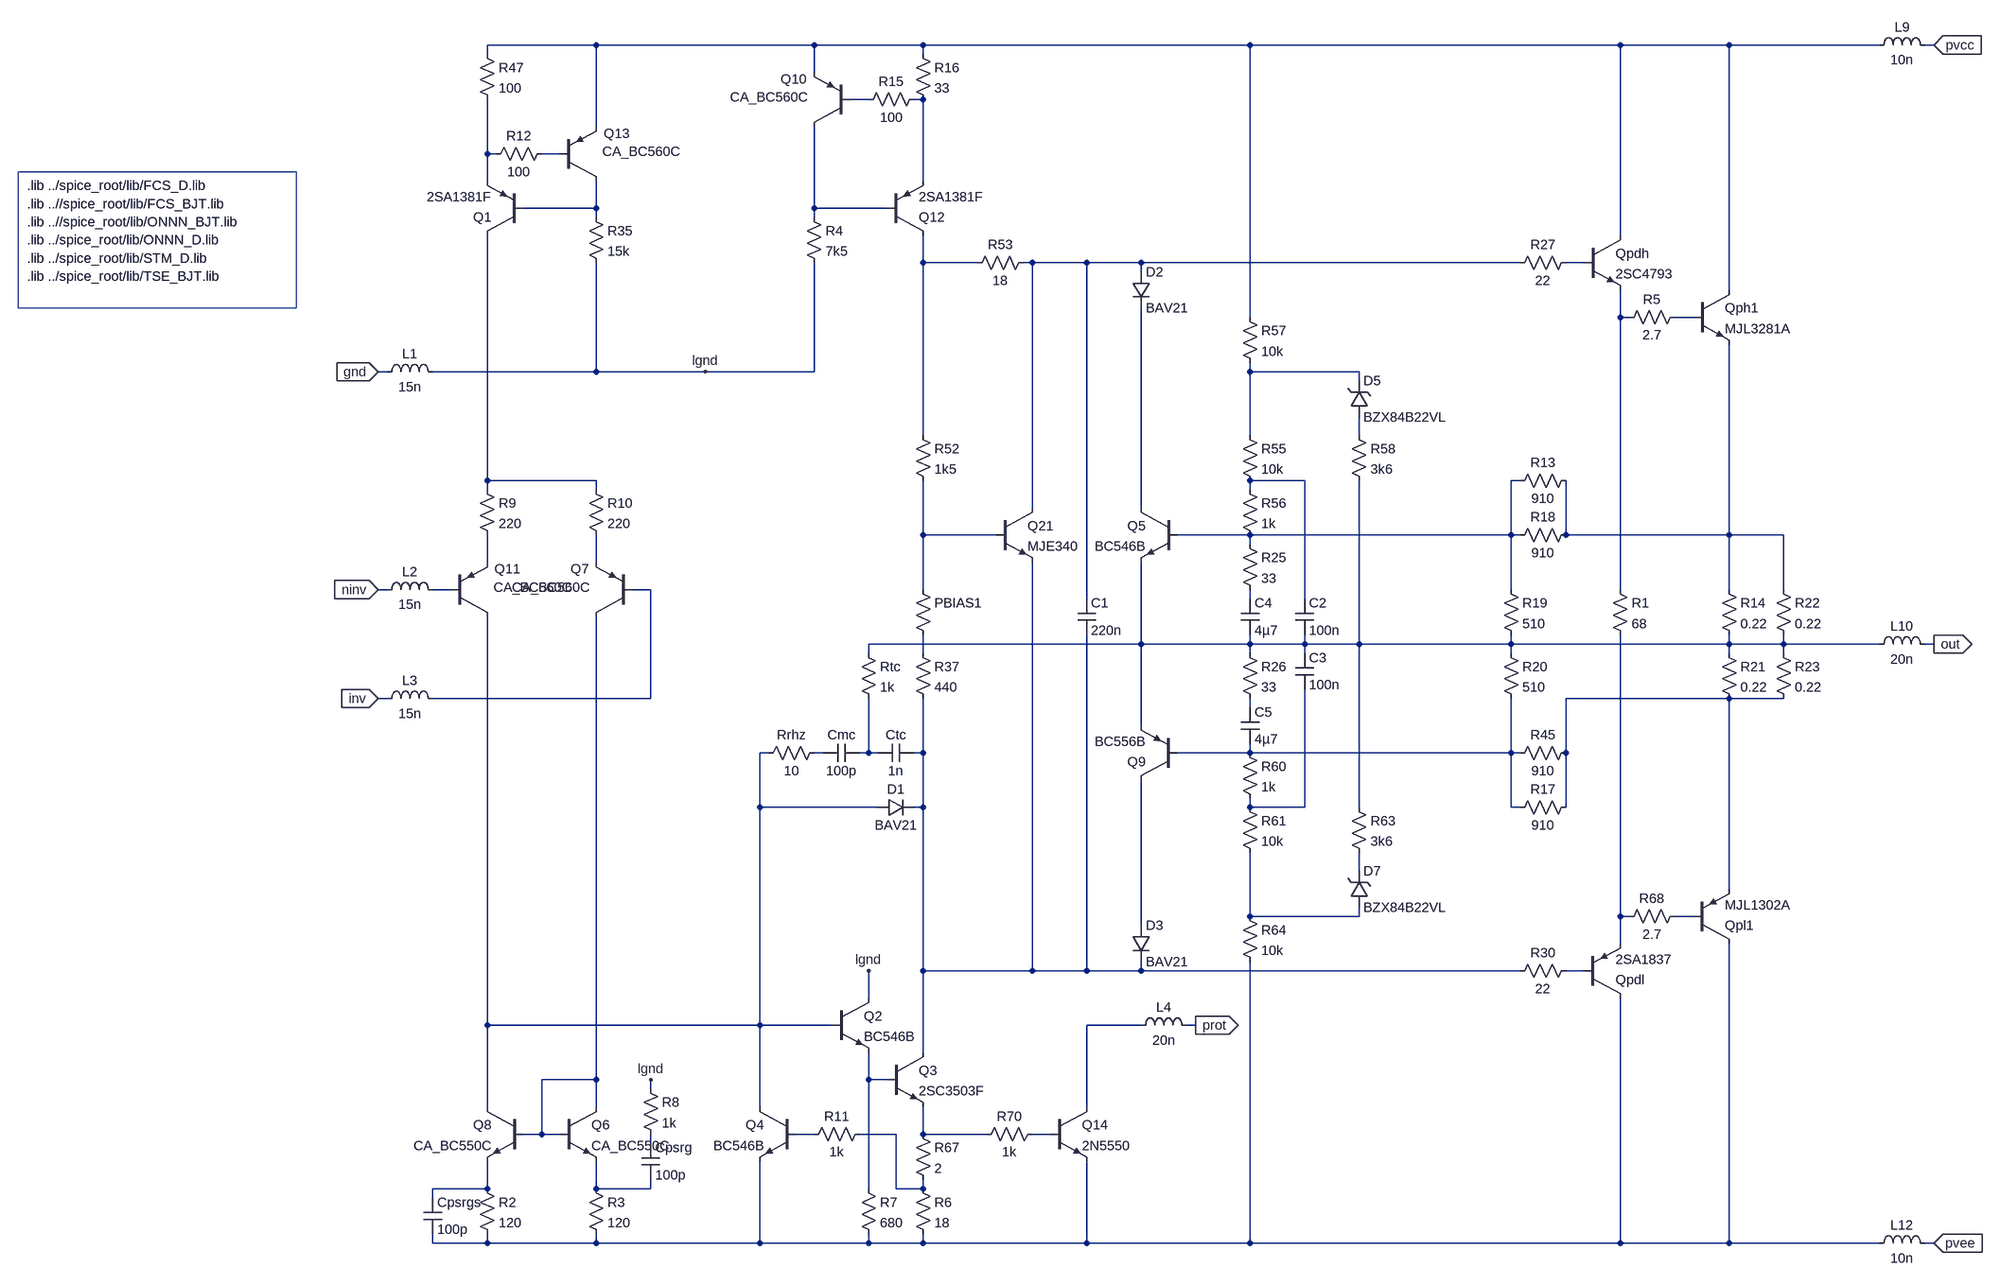
[diagram p0: schematic pab3bbb-compact-module-v2.asc]
pab3bbb-compact-module-v2.asc, the LTspice schematic file:
Version 4
SHEET 1 6124 2336
WIRE -192 -1280 -384 -1280
WIRE 192 -1280 -192 -1280
WIRE 384 -1280 192 -1280
WIRE 960 -1280 384 -1280
WIRE 1632 -1280 960 -1280
WIRE 1824 -1280 1632 -1280
WIRE 2592 -1280 1824 -1280
WIRE 2688 -1280 2672 -1280
WIRE -384 -1264 -384 -1280
WIRE 384 -1264 384 -1280
WIRE 192 -1232 192 -1280
WIRE 288 -1184 256 -1184
WIRE 384 -1184 368 -1184
WIRE -192 -1136 -192 -1280
WIRE -384 -1088 -384 -1184
WIRE -368 -1088 -384 -1088
WIRE -256 -1088 -288 -1088
WIRE -384 -1040 -384 -1088
WIRE 384 -1040 384 -1184
WIRE -192 -992 -192 -1040
WIRE -192 -992 -320 -992
WIRE 192 -992 192 -1136
WIRE 320 -992 192 -992
WIRE -192 -976 -192 -992
WIRE 192 -976 192 -992
WIRE 1632 -944 1632 -1280
WIRE 384 -896 384 -944
WIRE 480 -896 384 -896
WIRE 576 -896 560 -896
WIRE 672 -896 576 -896
WIRE 768 -896 672 -896
WIRE 1456 -896 768 -896
WIRE 1568 -896 1536 -896
WIRE 768 -880 768 -896
WIRE 1824 -848 1824 -1280
WIRE 960 -800 960 -1280
WIRE 1632 -800 1632 -848
WIRE 1648 -800 1632 -800
WIRE 1760 -800 1728 -800
WIRE -560 -704 -576 -704
WIRE -192 -704 -192 -896
WIRE -192 -704 -480 -704
WIRE 0 -704 -192 -704
WIRE 192 -704 192 -896
WIRE 192 -704 0 -704
WIRE 960 -704 960 -720
WIRE 1152 -704 960 -704
WIRE 1152 -688 1152 -704
WIRE 384 -592 384 -896
WIRE 960 -592 960 -704
WIRE 1152 -592 1152 -624
WIRE -384 -512 -384 -944
WIRE -192 -512 -384 -512
WIRE 1056 -512 960 -512
WIRE 1456 -512 1440 -512
WIRE -384 -496 -384 -512
WIRE -192 -496 -192 -512
WIRE 960 -496 960 -512
WIRE 576 -464 576 -896
WIRE 768 -464 768 -816
WIRE 384 -416 384 -512
WIRE 512 -416 384 -416
WIRE 960 -416 832 -416
WIRE 1440 -416 1440 -512
WIRE 1440 -416 960 -416
WIRE 1456 -416 1440 -416
WIRE 1536 -416 1536 -512
WIRE 1824 -416 1824 -752
WIRE 1824 -416 1536 -416
WIRE 1920 -416 1824 -416
WIRE 960 -400 960 -416
WIRE -384 -368 -384 -416
WIRE -192 -368 -192 -416
WIRE -560 -320 -576 -320
WIRE -448 -320 -480 -320
WIRE -96 -320 -128 -320
WIRE 384 -320 384 -416
WIRE 1440 -320 1440 -416
WIRE 1632 -320 1632 -800
WIRE 1824 -320 1824 -416
WIRE 1920 -320 1920 -416
WIRE 672 -304 672 -896
WIRE 960 -304 960 -320
WIRE 1056 -304 1056 -512
WIRE 768 -224 768 -368
WIRE 768 -224 288 -224
WIRE 960 -224 960 -240
WIRE 960 -224 768 -224
WIRE 1056 -224 1056 -240
WIRE 1056 -224 960 -224
WIRE 1152 -224 1152 -512
WIRE 1152 -224 1056 -224
WIRE 1440 -224 1440 -240
WIRE 1440 -224 1152 -224
WIRE 1824 -224 1824 -240
WIRE 1824 -224 1440 -224
WIRE 1920 -224 1920 -240
WIRE 1920 -224 1824 -224
WIRE 2592 -224 1920 -224
WIRE 2688 -224 2672 -224
WIRE 288 -208 288 -224
WIRE 384 -208 384 -240
WIRE 960 -208 960 -224
WIRE 1056 -208 1056 -224
WIRE 1440 -208 1440 -224
WIRE 1824 -208 1824 -224
WIRE 1920 -208 1920 -224
WIRE -560 -128 -576 -128
WIRE -96 -128 -96 -320
WIRE -96 -128 -480 -128
WIRE 1824 -128 1536 -128
WIRE 1920 -128 1824 -128
WIRE 960 -112 960 -128
WIRE 768 -80 768 -224
WIRE 112 -32 96 -32
WIRE 208 -32 192 -32
WIRE 288 -32 288 -128
WIRE 288 -32 272 -32
WIRE 304 -32 288 -32
WIRE 384 -32 384 -128
WIRE 384 -32 368 -32
WIRE 960 -32 960 -48
WIRE 960 -32 832 -32
WIRE 1440 -32 1440 -128
WIRE 1440 -32 960 -32
WIRE 1456 -32 1440 -32
WIRE 1536 -32 1536 -128
WIRE 96 64 96 -32
WIRE 304 64 96 64
WIRE 384 64 384 -32
WIRE 384 64 368 64
WIRE 960 64 960 48
WIRE 1056 64 1056 -144
WIRE 1056 64 960 64
WIRE 1152 64 1152 -224
WIRE 1440 64 1440 -32
WIRE 1456 64 1440 64
WIRE 1536 64 1536 -32
WIRE 1152 176 1152 144
WIRE 1824 208 1824 -128
WIRE 960 256 960 144
WIRE 1152 256 1152 240
WIRE 1152 256 960 256
WIRE 1632 256 1632 -240
WIRE 1648 256 1632 256
WIRE 1760 256 1728 256
WIRE 768 272 768 16
WIRE 1632 304 1632 256
WIRE 384 352 384 64
WIRE 576 352 576 -368
WIRE 576 352 384 352
WIRE 672 352 672 -240
WIRE 672 352 576 352
WIRE 768 352 768 336
WIRE 768 352 672 352
WIRE 1456 352 768 352
WIRE 1568 352 1536 352
WIRE 288 400 288 352
WIRE -384 448 -384 -272
WIRE 96 448 96 64
WIRE 96 448 -384 448
WIRE 224 448 96 448
WIRE 768 448 672 448
WIRE 864 448 848 448
WIRE 384 496 384 352
WIRE -192 544 -192 -272
WIRE -192 544 -288 544
WIRE 288 544 288 496
WIRE 320 544 288 544
WIRE -96 560 -96 544
WIRE -384 592 -384 448
WIRE -192 592 -192 544
WIRE 96 592 96 448
WIRE 672 592 672 448
WIRE -288 640 -288 544
WIRE -288 640 -320 640
WIRE -256 640 -288 640
WIRE 192 640 160 640
WIRE 336 640 272 640
WIRE 384 640 384 592
WIRE 496 640 384 640
WIRE 608 640 576 640
WIRE -96 656 -96 640
WIRE -384 736 -384 688
WIRE -384 736 -480 736
WIRE -192 736 -192 688
WIRE -96 736 -96 720
WIRE -96 736 -192 736
WIRE 288 736 288 544
WIRE 336 736 336 640
WIRE 384 736 384 720
WIRE 384 736 336 736
WIRE -480 752 -480 736
WIRE -480 832 -480 816
WIRE -384 832 -384 816
WIRE -384 832 -480 832
WIRE -192 832 -192 816
WIRE -192 832 -384 832
WIRE 96 832 96 688
WIRE 96 832 -192 832
WIRE 288 832 288 816
WIRE 288 832 96 832
WIRE 384 832 384 816
WIRE 384 832 288 832
WIRE 672 832 672 688
WIRE 672 832 384 832
WIRE 960 832 960 336
WIRE 960 832 672 832
WIRE 1632 832 1632 400
WIRE 1632 832 960 832
WIRE 1824 832 1824 304
WIRE 1824 832 1632 832
WIRE 2592 832 1824 832
WIRE 2688 832 2672 832
FLAG 2688 -1280 pvcc
IOPIN 2688 -1280 In
FLAG 2688 832 pvee
IOPIN 2688 832 In
FLAG 2688 -224 out
IOPIN 2688 -224 Out
FLAG -576 -320 ninv
IOPIN -576 -320 In
FLAG -576 -128 inv
IOPIN -576 -128 In
FLAG -576 -704 gnd
IOPIN -576 -704 In
FLAG 0 -704 lgnd
FLAG 288 352 lgnd
FLAG -96 544 lgnd
FLAG 864 448 prot
IOPIN 864 448 Out
SYMBOL pnp -448 -272 M180
WINDOW 0 77 84 Left 2
WINDOW 3 75 52 Left 2
SYMATTR InstName Q11
SYMATTR Value CA_BC560C
SYMBOL res -400 720 R0
SYMATTR InstName R2
SYMATTR Value 120
SYMBOL res -208 720 R0
SYMATTR InstName R3
SYMATTR Value 120
SYMBOL res -400 -512 R0
SYMATTR InstName R9
SYMATTR Value 220
SYMBOL res -208 -512 R0
SYMATTR InstName R10
SYMATTR Value 220
SYMBOL res 368 -1280 R0
SYMATTR InstName R16
SYMATTR Value 33
SYMBOL pnp 320 -944 M180
SYMATTR InstName Q12
SYMATTR Value 2SA1381F
SYMBOL res 1552 -912 R90
WINDOW 0 0 56 VBottom 2
WINDOW 3 32 56 VTop 2
SYMATTR InstName R27
SYMATTR Value 22
SYMBOL res 1552 336 R90
WINDOW 0 0 56 VBottom 2
WINDOW 3 32 56 VTop 2
SYMATTR InstName R30
SYMATTR Value 22
SYMBOL res -400 -1280 R0
SYMATTR InstName R47
SYMATTR Value 100
SYMBOL res 368 -336 R0
WINDOW 3 36 76 Invisible 2
SYMATTR Value {1+(500*BIAS)}
SYMATTR InstName PBIAS1
SYMBOL res 368 -608 R0
SYMATTR InstName R52
SYMATTR Value 1k5
SYMBOL res 576 -912 R90
WINDOW 0 0 56 VBottom 2
WINDOW 3 32 56 VTop 2
SYMATTR InstName R53
SYMATTR Value 18
SYMBOL npn 320 496 R0
SYMATTR InstName Q3
SYMATTR Value 2SC3503F
SYMBOL res 368 720 R0
SYMATTR InstName R6
SYMATTR Value 18
SYMBOL res 176 -992 R0
SYMATTR InstName R4
SYMATTR Value 7k5
SYMBOL pnp -320 -944 R180
SYMATTR InstName Q1
SYMATTR Value 2SA1381F
SYMBOL pnp -128 -272 R180
WINDOW 0 77 84 Left 2
WINDOW 3 75 52 Left 2
SYMATTR InstName Q7
SYMATTR Value CA_BC560C
SYMBOL npn 512 -464 R0
SYMATTR InstName Q21
SYMATTR Value MJE340
SYMBOL res 368 -224 R0
SYMATTR InstName R37
SYMATTR Value 440
SYMBOL npn 1760 -848 R0
SYMATTR InstName Qph1
SYMATTR Value MJL3281A
SYMBOL pnp 1760 304 M180
SYMATTR InstName Qpl1
SYMATTR Value MJL1302A
SYMBOL res 1744 -816 R90
WINDOW 0 0 56 VBottom 2
WINDOW 3 32 56 VTop 2
SYMATTR InstName R5
SYMATTR Value 2.7
SYMBOL res 1744 240 R90
WINDOW 0 0 56 VBottom 2
WINDOW 3 32 56 VTop 2
SYMATTR InstName R68
SYMATTR Value 2.7
SYMBOL cap 272 -48 R90
WINDOW 0 0 32 VBottom 2
WINDOW 3 32 32 VTop 2
SYMATTR InstName Cmc
SYMATTR Value 100p
SYMATTR SpiceLine V=100 Irms=20.8m Rser=5.448 Lser=3n Rpar=6.4meg Cpar=1p
SYMBOL npn -256 592 R0
SYMATTR InstName Q6
SYMATTR Value CA_BC550C
SYMBOL npn -320 592 M0
SYMATTR InstName Q8
SYMATTR Value CA_BC550C
SYMBOL res 384 -1200 R90
WINDOW 0 0 56 VBottom 2
WINDOW 3 32 56 VTop 2
SYMATTR InstName R15
SYMATTR Value 100
SYMBOL npn 224 400 R0
SYMATTR InstName Q2
SYMATTR Value BC546B
SYMBOL res 272 720 R0
SYMATTR InstName R7
SYMATTR Value 680
SYMBOL cap 368 -48 R90
WINDOW 0 0 32 VBottom 2
WINDOW 3 32 32 VTop 2
SYMATTR InstName Ctc
SYMATTR Value 1n
SYMATTR SpiceLine V=100 Irms=75.3m Rser=2.89088 Lser=3n Rpar=4.4meg Cpar=1p
SYMBOL res 272 -224 R0
SYMATTR InstName Rtc
SYMATTR Value 1k
SYMBOL diode 304 80 R270
WINDOW 0 32 32 VTop 2
WINDOW 3 0 32 VBottom 2
SYMATTR InstName D1
SYMATTR Value BAV21
SYMBOL pnp 256 -1136 R180
WINDOW 0 77 84 Left 2
WINDOW 3 75 52 Left 2
SYMATTR InstName Q10
SYMATTR Value CA_BC560C
SYMBOL res 1808 -336 R0
SYMATTR InstName R14
SYMATTR Value 0.22
SYMBOL res 1808 -224 R0
SYMATTR InstName R21
SYMATTR Value 0.22
SYMBOL res -208 -992 R0
SYMATTR InstName R35
SYMATTR Value 15k
SYMBOL cap 656 -240 M180
WINDOW 0 24 56 Left 2
WINDOW 3 24 8 Left 2
SYMATTR InstName C1
SYMATTR Value 220n
SYMATTR SpiceLine V=25 Irms=1.76 Rser=0.057522 Lser=3n Rpar=4.4meg Cpar=1p
SYMBOL ind -576 -688 R270
WINDOW 0 32 56 VTop 2
WINDOW 3 5 56 VBottom 2
SYMATTR InstName L1
SYMATTR Value 15n
SYMATTR SpiceLine Rser=20m
SYMBOL ind -576 -304 R270
WINDOW 0 32 56 VTop 2
WINDOW 3 5 56 VBottom 2
SYMATTR InstName L2
SYMATTR Value 15n
SYMATTR SpiceLine Rser=20m
SYMBOL ind -576 -112 R270
WINDOW 0 32 56 VTop 2
WINDOW 3 5 56 VBottom 2
SYMATTR InstName L3
SYMATTR Value 15n
SYMATTR SpiceLine Rser=20m
SYMBOL ind 2576 -208 R270
WINDOW 0 32 56 VTop 2
WINDOW 3 5 56 VBottom 2
SYMATTR InstName L10
SYMATTR Value 20n
SYMATTR SpiceLine Rser=10m
SYMBOL ind 2576 -1264 R270
WINDOW 0 32 56 VTop 2
WINDOW 3 5 56 VBottom 2
SYMATTR InstName L9
SYMATTR Value 10n
SYMATTR SpiceLine Rser=10m
SYMBOL ind 2576 848 R270
WINDOW 0 32 56 VTop 2
WINDOW 3 5 56 VBottom 2
SYMATTR InstName L12
SYMATTR Value 10n
SYMATTR SpiceLine Rser=10m
SYMBOL pnp -256 -1040 M180
WINDOW 0 77 84 Left 2
WINDOW 3 75 52 Left 2
SYMATTR InstName Q13
SYMATTR Value CA_BC560C
SYMBOL res -272 -1104 R90
WINDOW 0 0 56 VBottom 2
WINDOW 3 32 56 VTop 2
SYMATTR InstName R12
SYMATTR Value 100
SYMBOL npn 1568 -944 R0
SYMATTR InstName Qpdh
SYMATTR Value 2SC4793
SYMBOL pnp 1568 400 M180
SYMATTR InstName Qpdl
SYMATTR Value 2SA1837
SYMBOL res 1616 -336 R0
SYMATTR InstName R1
SYMATTR Value 68
SYMBOL cap -496 752 R0
SYMATTR InstName Cpsrgs
SYMATTR Value 100p
SYMATTR SpiceLine V=100 Irms=20.8m Rser=5.448 Lser=3n Rpar=6.4meg Cpar=1p
SYMBOL cap -112 656 R0
SYMATTR InstName Cpsrg
SYMATTR Value 100p
SYMATTR SpiceLine V=100 Irms=20.8m Rser=5.448 Lser=3n Rpar=6.4meg Cpar=1p
SYMBOL res 1904 -336 R0
SYMATTR InstName R22
SYMATTR Value 0.22
SYMBOL res 1904 -224 R0
SYMATTR InstName R23
SYMATTR Value 0.22
SYMBOL res 208 -48 R90
WINDOW 0 0 56 VBottom 2
WINDOW 3 32 56 VTop 2
SYMATTR InstName Rrhz
SYMATTR Value 10
SYMBOL ind 752 464 R270
WINDOW 0 32 56 VTop 2
WINDOW 3 5 56 VBottom 2
SYMATTR InstName L4
SYMATTR Value 20n
SYMATTR SpiceLine Rser=10m
SYMBOL npn 160 592 M0
SYMATTR InstName Q4
SYMATTR Value BC546B
SYMBOL res 288 624 R90
WINDOW 0 0 56 VBottom 2
WINDOW 3 32 56 VTop 2
SYMATTR InstName R11
SYMATTR Value 1k
SYMBOL npn 832 -464 M0
SYMATTR InstName Q5
SYMATTR Value BC546B
SYMBOL res 1552 -432 R90
WINDOW 0 0 56 VBottom 2
WINDOW 3 32 56 VTop 2
SYMATTR InstName R18
SYMATTR Value 910
SYMBOL res 1424 -336 R0
SYMATTR InstName R19
SYMATTR Value 510
SYMBOL diode 752 -880 R0
SYMATTR InstName D2
SYMATTR Value BAV21
SYMBOL pnp 832 16 R180
SYMATTR InstName Q9
SYMATTR Value BC556B
SYMBOL res 1424 -224 R0
SYMATTR InstName R20
SYMATTR Value 510
SYMBOL res 1552 -48 R90
WINDOW 0 0 56 VBottom 2
WINDOW 3 32 56 VTop 2
SYMATTR InstName R45
SYMATTR Value 910
SYMBOL diode 752 272 R0
SYMATTR InstName D3
SYMATTR Value BAV21
SYMBOL res 944 -608 R0
SYMATTR InstName R55
SYMATTR Value 10k
SYMBOL res 944 -512 R0
SYMATTR InstName R56
SYMATTR Value 1k
SYMBOL res 944 -816 R0
SYMATTR InstName R57
SYMATTR Value 10k
SYMBOL zener 1136 -624 M180
WINDOW 0 24 64 Left 2
WINDOW 3 24 0 Left 2
SYMATTR InstName D5
SYMATTR Value BZX84B22VL
SYMATTR Description Diode
SYMATTR Type diode
SYMBOL res 1136 -608 R0
SYMATTR InstName R58
SYMATTR Value 3k6
SYMBOL res 944 -48 R0
SYMATTR InstName R60
SYMATTR Value 1k
SYMBOL res 944 48 R0
SYMATTR InstName R61
SYMATTR Value 10k
SYMBOL res 1136 48 R0
SYMATTR InstName R63
SYMATTR Value 3k6
SYMBOL zener 1136 240 M180
WINDOW 0 24 64 Left 2
WINDOW 3 24 0 Left 2
SYMATTR InstName D7
SYMATTR Value BZX84B22VL
SYMATTR Description Diode
SYMATTR Type diode
SYMBOL res 944 240 R0
SYMATTR InstName R64
SYMATTR Value 10k
SYMBOL res 368 624 R0
SYMATTR InstName R67
SYMATTR Value 2
SYMBOL npn 608 592 R0
SYMATTR InstName Q14
SYMATTR Value 2N5550
SYMBOL res 592 624 R90
WINDOW 0 0 56 VBottom 2
WINDOW 3 32 56 VTop 2
SYMATTR InstName R70
SYMATTR Value 1k
SYMBOL res 1552 -528 R90
WINDOW 0 0 56 VBottom 2
WINDOW 3 32 56 VTop 2
SYMATTR InstName R13
SYMATTR Value 910
SYMBOL res 1552 48 R90
WINDOW 0 0 56 VBottom 2
WINDOW 3 32 56 VTop 2
SYMATTR InstName R17
SYMATTR Value 910
SYMBOL res 944 -416 R0
SYMATTR InstName R25
SYMATTR Value 33
SYMBOL res 944 -224 R0
SYMATTR InstName R26
SYMATTR Value 33
SYMBOL cap 1040 -240 M180
WINDOW 0 24 56 Left 2
WINDOW 3 24 8 Left 2
SYMATTR InstName C2
SYMATTR Value 100n
SYMATTR SpiceLine V=25 Irms=1.76 Rser=0.057522 Lser=3n Rpar=4.4meg Cpar=1p
SYMBOL cap 1040 -144 M180
WINDOW 0 24 56 Left 2
WINDOW 3 24 8 Left 2
SYMATTR InstName C3
SYMATTR Value 100n
SYMATTR SpiceLine V=25 Irms=1.76 Rser=0.057522 Lser=3n Rpar=4.4meg Cpar=1p
SYMBOL cap 944 -240 M180
WINDOW 0 24 56 Left 2
WINDOW 3 24 8 Left 2
SYMATTR InstName C4
SYMATTR Value 4µ7
SYMATTR SpiceLine V=25 Irms=1.76 Rser=0.057522 Lser=3n Rpar=4.4meg Cpar=1p
SYMBOL cap 944 -48 M180
WINDOW 0 24 56 Left 2
WINDOW 3 24 8 Left 2
SYMATTR InstName C5
SYMATTR Value 4µ7
SYMATTR SpiceLine V=25 Irms=1.76 Rser=0.057522 Lser=3n Rpar=4.4meg Cpar=1p
SYMBOL res -112 544 R0
SYMATTR InstName R8
SYMATTR Value 1k
TEXT -1376 -968 Left 2 !.lib ..//spice_root/lib/ONNN_BJT.lib
TEXT -1376 -904 Left 2 !.lib ../spice_root/lib/STM_D.lib
TEXT -1376 -1000 Left 2 !.lib ..//spice_root/lib/FCS_BJT.lib
TEXT -1376 -1032 Left 2 !.lib ../spice_root/lib/FCS_D.lib
TEXT -1376 -936 Left 2 !.lib ../spice_root/lib/ONNN_D.lib
TEXT -1376 -872 Left 2 !.lib ../spice_root/lib/TSE_BJT.lib
RECTANGLE Normal -720 -816 -1392 -1056

The netlist it stands for:
* pab3bbb-compact-module-v2.asc
Q11 N030 N023 N021 0 CA_BC560C
R2 N050 N052 120
R3 N051 N052 120
R9 N015 N021 220
R10 N015 N022 220
R16 N001 N003 33
Q12 N008 N007 N003 0 2SA1381F
R27 N010 N009 22
R30 N041 N033 22
R47 N001 N004 100
R§PBIAS1 N019 N027 {1+(500*BIAS)}
R52 N008 N019 1k5
R53 N009 N008 18
Q3 N033 N044 N047 0 2SC3503F
R6 N046 N052 18
R4 N007 lgnd 7k5
Q1 N015 N006 N004 0 2SA1381F
Q7 N043 N024 N022 0 CA_BC560C
Q21 N009 N019 N033 0 MJE340
R37 N027 N033 440
Qph1 N001 N012 N020 0 MJL3281A
Qpl1 N052 N039 N028 0 MJL1302A
R5 N012 N011 2.7
R68 N039 N038 2.7
Cmc N032 N031 100p V=100 Irms=20.8m Rser=5.448 Lser=3n Rpar=6.4meg Cpar=1p
Q6 N043 N043 N051 0 CA_BC550C
Q8 N030 N043 N050 0 CA_BC550C
R15 N003 N002 100
Q2 lgnd N030 N044 0 BC546B
R7 N044 N052 680
Ctc N033 N032 1n V=100 Irms=75.3m Rser=2.89088 Lser=3n Rpar=4.4meg Cpar=1p
Rtc N026 N032 1k
D1 N030 N033 BAV21
Q10 N007 N002 N001 0 CA_BC560C
R14 N020 N026 0.22
R21 N026 N028 0.22
R35 N006 lgnd 15k
C1 N033 N009 220n V=25 Irms=1.76 Rser=0.057522 Lser=3n Rpar=4.4meg Cpar=1p
L1 gnd lgnd 15n Rser=20m
L2 ninv N023 15n Rser=20m
L3 inv N024 15n Rser=20m
L10 N026 out 20n Rser=10m
L9 N001 pvcc 10n Rser=10m
L12 N052 pvee 10n Rser=10m
Q13 N006 N005 N001 0 CA_BC560C
R12 N005 N004 100
Qpdh N001 N010 N011 0 2SC4793
Qpdl N052 N041 N038 0 2SA1837
R1 N011 N038 68
Cpsrgs N050 N052 100p V=100 Irms=20.8m Rser=5.448 Lser=3n Rpar=6.4meg Cpar=1p
Cpsrg N049 N051 100p V=100 Irms=20.8m Rser=5.448 Lser=3n Rpar=6.4meg Cpar=1p
R22 N020 N026 0.22
R23 N026 N028 0.22
Rrhz N031 N030 10
L4 N042 prot 20n Rser=10m
Q4 N030 N045 N052 0 BC546B
R11 N046 N045 1k
Q5 N018 N017 N026 0 BC546B
R18 N020 N017 910
R19 N017 N026 510
D2 N009 N018 BAV21
Q9 N040 N034 N026 0 BC556B
R20 N026 N034 510
R45 N028 N034 910
D3 N040 N033 BAV21
R55 N013 N016 10k
R56 N016 N017 1k
R57 N001 N013 10k
D5 N014 N013 BZX84B22VL
R58 N014 N026 3k6
R60 N034 N035 1k
R61 N035 N037 10k
R63 N026 N036 3k6
D7 N037 N036 BZX84B22VL
R64 N037 N052 10k
R67 N047 N046 2
Q14 N042 N048 N052 0 2N5550
R70 N048 N047 1k
R13 N020 N017 910
R17 N028 N034 910
R25 N017 N025 33
R26 N026 N029 33
C2 N026 N016 100n V=25 Irms=1.76 Rser=0.057522 Lser=3n Rpar=4.4meg Cpar=1p
C3 N035 N026 100n V=25 Irms=1.76 Rser=0.057522 Lser=3n Rpar=4.4meg Cpar=1p
C4 N026 N025 4µ7 V=25 Irms=1.76 Rser=0.057522 Lser=3n Rpar=4.4meg Cpar=1p
C5 N034 N029 4µ7 V=25 Irms=1.76 Rser=0.057522 Lser=3n Rpar=4.4meg Cpar=1p
R8 lgnd N049 1k
.model D D
.lib standard.dio
.model NPN NPN
.model PNP PNP
.lib standard.bjt
.lib ..//spice_root/lib/ONNN_BJT.lib
.lib ../spice_root/lib/STM_D.lib
.lib ..//spice_root/lib/FCS_BJT.lib
.lib ../spice_root/lib/FCS_D.lib
.lib ../spice_root/lib/ONNN_D.lib
.lib ../spice_root/lib/TSE_BJT.lib
.backanno
.end